# EAGLE design Hauptplatine (EAGLE 5.12)
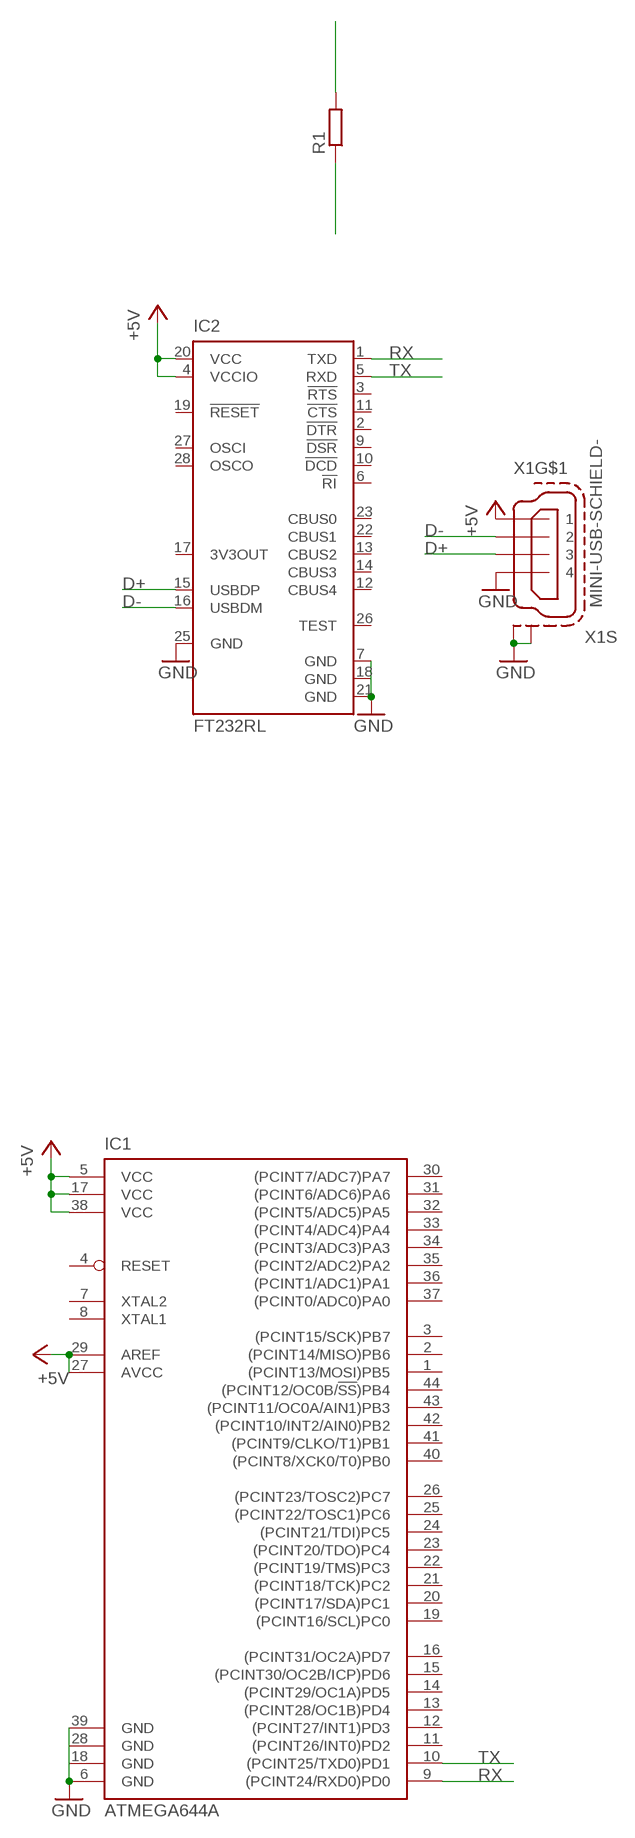
[diagram p0: schematic, sheet 1]

## Parts
IC1  ATMEGA644A  [TQFP44]
IC2  FT232RL  [SSOP28]
R1  R-EU_R1206  [R1206]
X1  MINI-USB-SCHIELD-  [USB]

## Nets
+5V: IC1.5(VCC) IC1.17(VCC) IC1.27(AVCC) IC1.29(AREF) IC1.38(VCC) IC2.4(VCCIO) IC2.20(VCC) X1.1
D+: IC2.15(USBDP) X1.3
D-: IC2.16(USBDM) X1.2
GND: IC1.6(GND) IC1.39(GND) IC2.7(GND) IC2.21(GND) IC2.25(GND) X1.4 X1.GND1(S:S1) X1.GND2(S:S2)
RX: IC1.9((PCINT24/RXD0)PD0) IC2.1(TXD)
TX: IC1.10((PCINT25/TXD0)PD1) IC2.5(RXD) R1.1 R1.2
Unconnected: IC1.1((PCINT13/MOSI)PB5) IC1.2((PCINT14/MISO)PB6) IC1.3((PCINT15/SCK)PB7) IC1.4(RESET) IC1.7(XTAL2) IC1.8(XTAL1) IC1.11((PCINT26/INT0)PD2) IC1.12((PCINT27/INT1)PD3) IC1.13((PCINT28/OC1B)PD4) IC1.14((PCINT29/OC1A)PD5) IC1.15((PCINT30/OC2B/ICP)PD6) IC1.16((PCINT31/OC2A)PD7) IC1.19((PCINT16/SCL)PC0) IC1.20((PCINT17/SDA)PC1) IC1.21((PCINT18/TCK)PC2) IC1.22((PCINT19/TMS)PC3) IC1.23((PCINT20/TDO)PC4) IC1.24((PCINT21/TDI)PC5) IC1.25((PCINT22/TOSC1)PC6) IC1.26((PCINT23/TOSC2)PC7) IC1.30((PCINT7/ADC7)PA7) IC1.31((PCINT6/ADC6)PA6) IC1.32((PCINT5/ADC5)PA5) IC1.33((PCINT4/ADC4)PA4) IC1.34((PCINT3/ADC3)PA3) IC1.35((PCINT2/ADC2)PA2) IC1.36((PCINT1/ADC1)PA1) IC1.37((PCINT0/ADC0)PA0) IC1.40((PCINT8/XCK0/T0)PB0) IC1.41((PCINT9/CLKO/T1)PB1) IC1.42((PCINT10/INT2/AIN0)PB2) IC1.43((PCINT11/OC0A/AIN1)PB3) IC1.44((PCINT12/OC0B/!SS!)PB4) IC2.2(!DTR) IC2.3(!RTS) IC2.6(!RI) IC2.9(!DSR) IC2.10(!DCD) IC2.11(!CTS) IC2.12(CBUS4) IC2.13(CBUS2) IC2.14(CBUS3) IC2.17(3V3OUT) IC2.19(!RESET) IC2.22(CBUS1) IC2.23(CBUS0) IC2.26(TEST) IC2.27(OSCI) IC2.28(OSCO)

## Power pins joined to a net without a drawn wire
GND: IC1.18(GND) IC1.28(GND) IC2.18(GND)

## Library data of the parts
IC1 = atmel:ATMEGA644: 8-bit Microcontroller with 64K Bytes In-System Programmable Flash Source: http://www.atmel.com/dyn/resources/prod_documents/doc2593.pdf; MPN: ATMEGA644PV-10AU; OC_FARNELL: 1455123; OC_NEWARK: 58M3748
IC2 = ftdichip:FT232R: Source: http://www.ftdichip.com/Documents/DataSheets/DS_FT232R_v104.pdf; MPN: FT232RL; OC_FARNELL: 1146032; OC_NEWARK: 91K9918
R1 = rcl:R-EU_: RESISTOR, European symbol
X1 = usb:MINI-USB-SCHIELD-: MINI USB-B Conector Source: www.cypressindustries.com

## Board
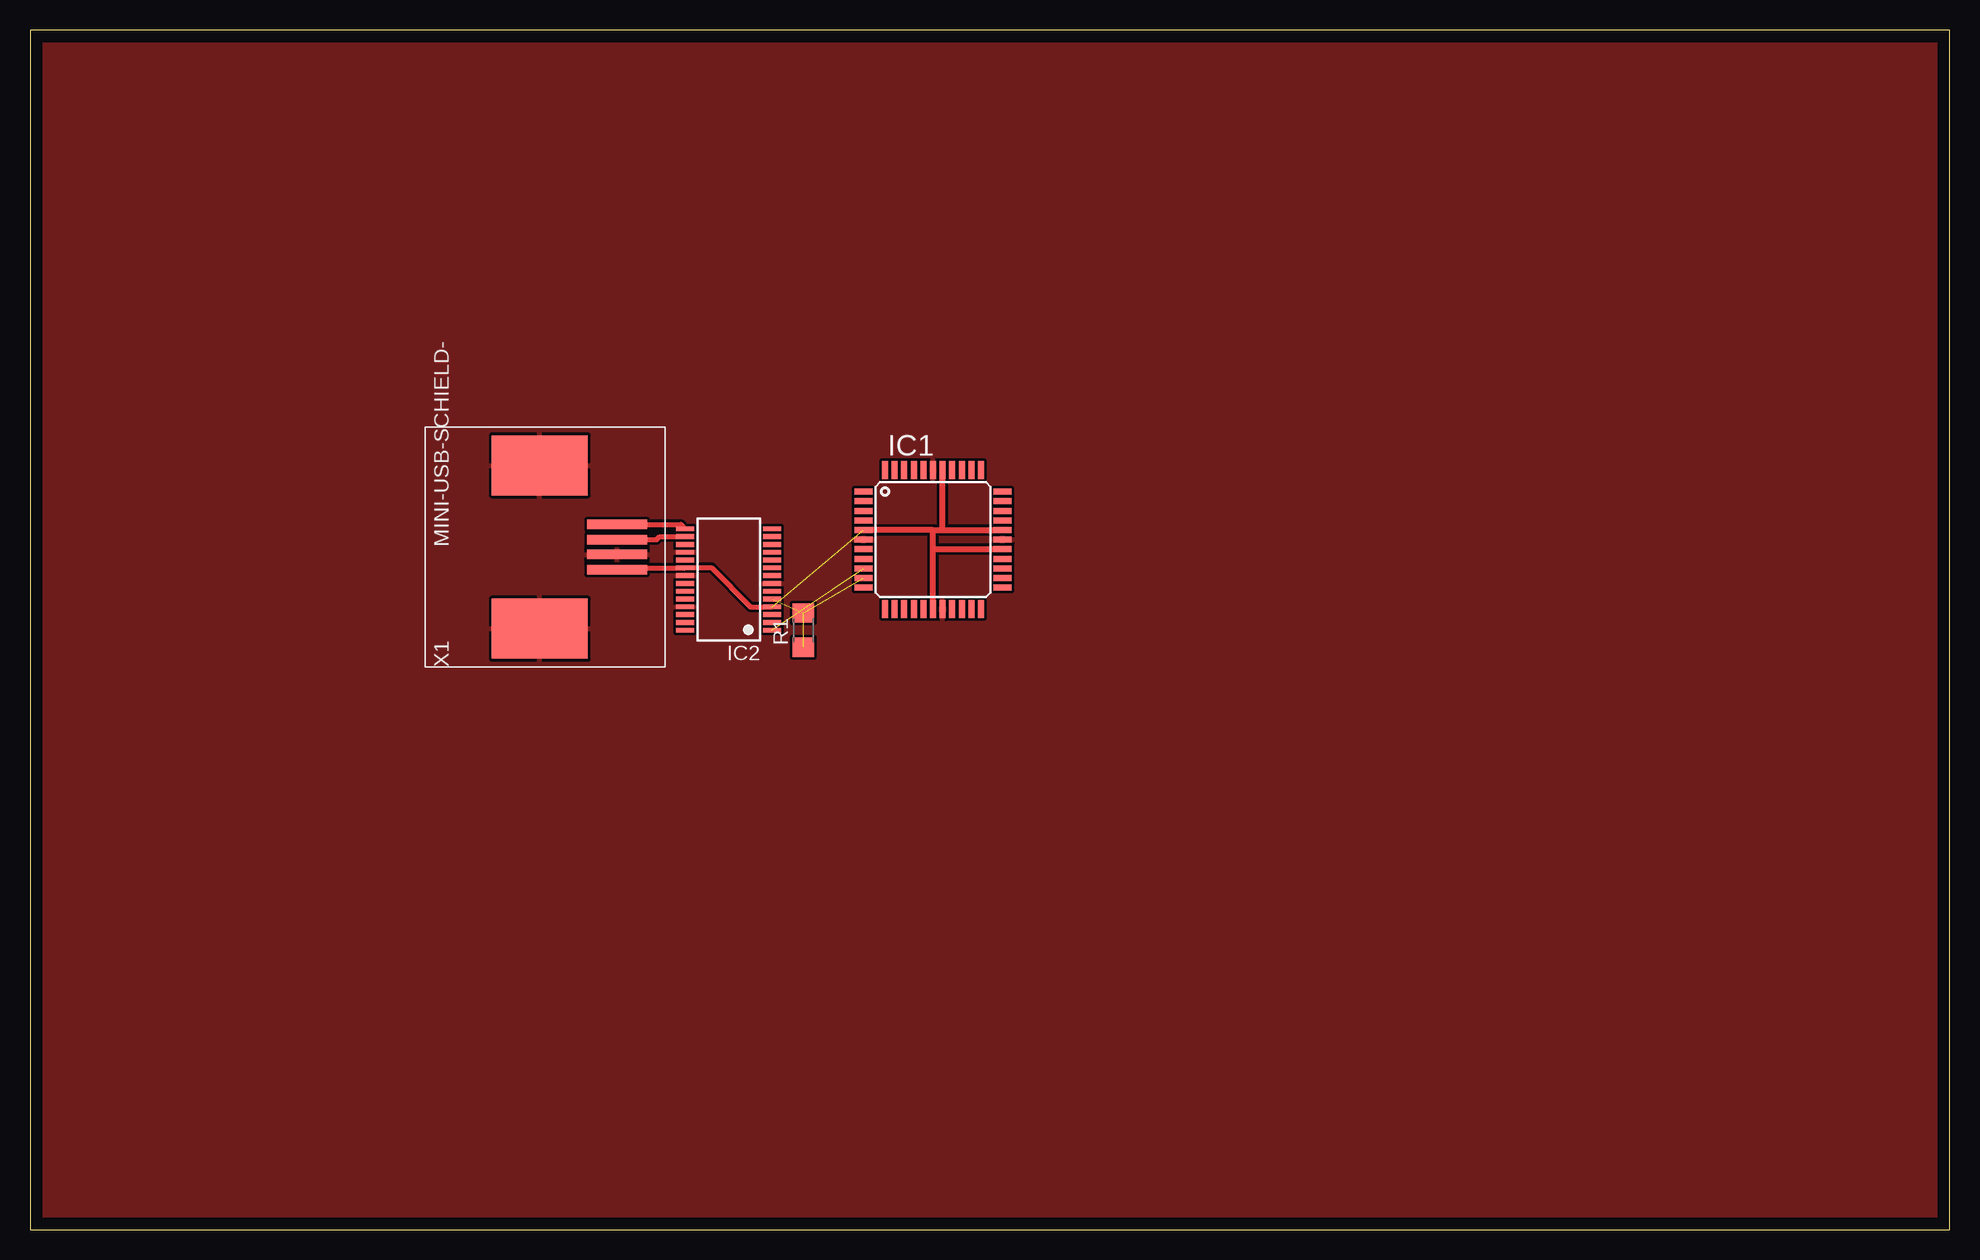
[diagram p1: board, top side]

Size 160 x 100 mm. Coordinates in mm from the lower left corner, seen from the top.
Outline: 0,0 160,0 160,100 0,100 0,0
Copper layers (1*16): Top 0.035mm / dielectric 1.5mm / Bottom 0.035mm
Design rules "default *": minimum track width 12mil, minimum drill 1mil, track to track 9mil, track to pad 9mil, pad to pad 9mil, via to via 9mil, smd to smd 9mil, copper to edge 40mil, drill to drill 12mil, minimum pad ring 10mil, minimum via ring 8mil, stop-mask expansion 4mil, vias tented up to drill 0mil, thermal gap 10mil

### Footprints (pad centres in the part's own frame; a part is rotated, then mirrored left to right if it is on the bottom)
TQFP44 = smd 1.5 x 0.5: 1 -5.8,4; 2 -5.8,3.2; 3 -5.8,2.4; 4 -5.8,1.6; 5 -5.8,0.8; 6 -5.8,0; 7 -5.8,-0.8; 8 -5.8,-1.6; 9 -5.8,-2.4; 10 -5.8,-3.2; 11 -5.8,-4; 23 5.8,-4; 24 5.8,-3.2; 25 5.8,-2.4; 26 5.8,-1.6; 27 5.8,-0.8; 28 5.8,0; 29 5.8,0.8; 30 5.8,1.6; 31 5.8,2.4; 32 5.8,3.2; 33 5.8,4 | smd 0.5 x 1.5: 12 -4,-5.8; 13 -3.2,-5.8; 14 -2.4,-5.8; 15 -1.6,-5.8; 16 -0.8,-5.8; 17 0,-5.8; 18 0.8,-5.8; 19 1.6,-5.8; 20 2.4,-5.8; 21 3.2,-5.8; 22 4,-5.8; 34 4,5.8; 35 3.2,5.8; 36 2.4,5.8; 37 1.6,5.8; 38 0.8,5.8; 39 0,5.8; 40 -0.8,5.8; 41 -1.6,5.8; 42 -2.4,5.8; 43 -3.2,5.8; 44 -4,5.8
SSOP28 = smd 0.4 x 1.5: 1 -4.225,-3.625; 2 -3.575,-3.625; 3 -2.925,-3.625; 4 -2.275,-3.625; 5 -1.625,-3.625; 6 -0.975,-3.625; 7 -0.325,-3.625; 8 0.325,-3.625; 9 0.975,-3.625; 10 1.625,-3.625; 11 2.275,-3.625; 12 2.925,-3.625; 13 3.575,-3.625; 14 4.225,-3.625; 15 4.225,3.625; 16 3.575,3.625; 17 2.925,3.625; 18 2.275,3.625; 19 1.625,3.625; 20 0.975,3.625; 21 0.325,3.625; 22 -0.325,3.625; 23 -0.975,3.625; 24 -1.625,3.625; 25 -2.275,3.625; 26 -2.925,3.625; 27 -3.575,3.625; 28 -4.225,3.625
R1206 = smd 1.6 x 1.803: 1 -1.422,0; 2 1.422,0
USB = smd 5 x 0.8: 1 16,-1.88; 2 16,0.62; 3 16,1.88; 4 16,-0.62 | smd 8 x 5: GND1 9.58,6.8; GND2 9.58,-6.8

### Placement (x,y rotation side)
IC1  75.27,57.51 0 top
IC2  58.25,54.19 90 top
R1  64.47,49.96 90 top
X1  32.92,56.9 0 top

### Tracks (layer width: path | path; a pad name or v marks a point on that pad's centre or on a via)
+5V  (1 unrouted)
  Top 0.406: IC2.4 60.05,51.91 56.79,55.17 IC2.20 49.07,55.16 X1.1
  Top 0.508: 75.27,58.31 IC1.5 | IC1.17 75.27,56.71 | 75.27,58.31 76.07,58.31 | 76.07,58.31 IC1.38 | 76.07,58.31 IC1.29 | 75.27,56.71 IC1.27 | 75.27,56.71 75.27,58.31
D+
  Top 0.406: X1.3 54.26,58.78 IC2.15
D-
  Top 0.406: X1.2 52.23,57.52 52.48,57.76 IC2.16
GND
  pour Top: 160,0 0,0 0,100 160,100
RX  (1 unrouted)
TX  (3 unrouted)